# Altium project Battery Chargers BQ24072.PrjPcb
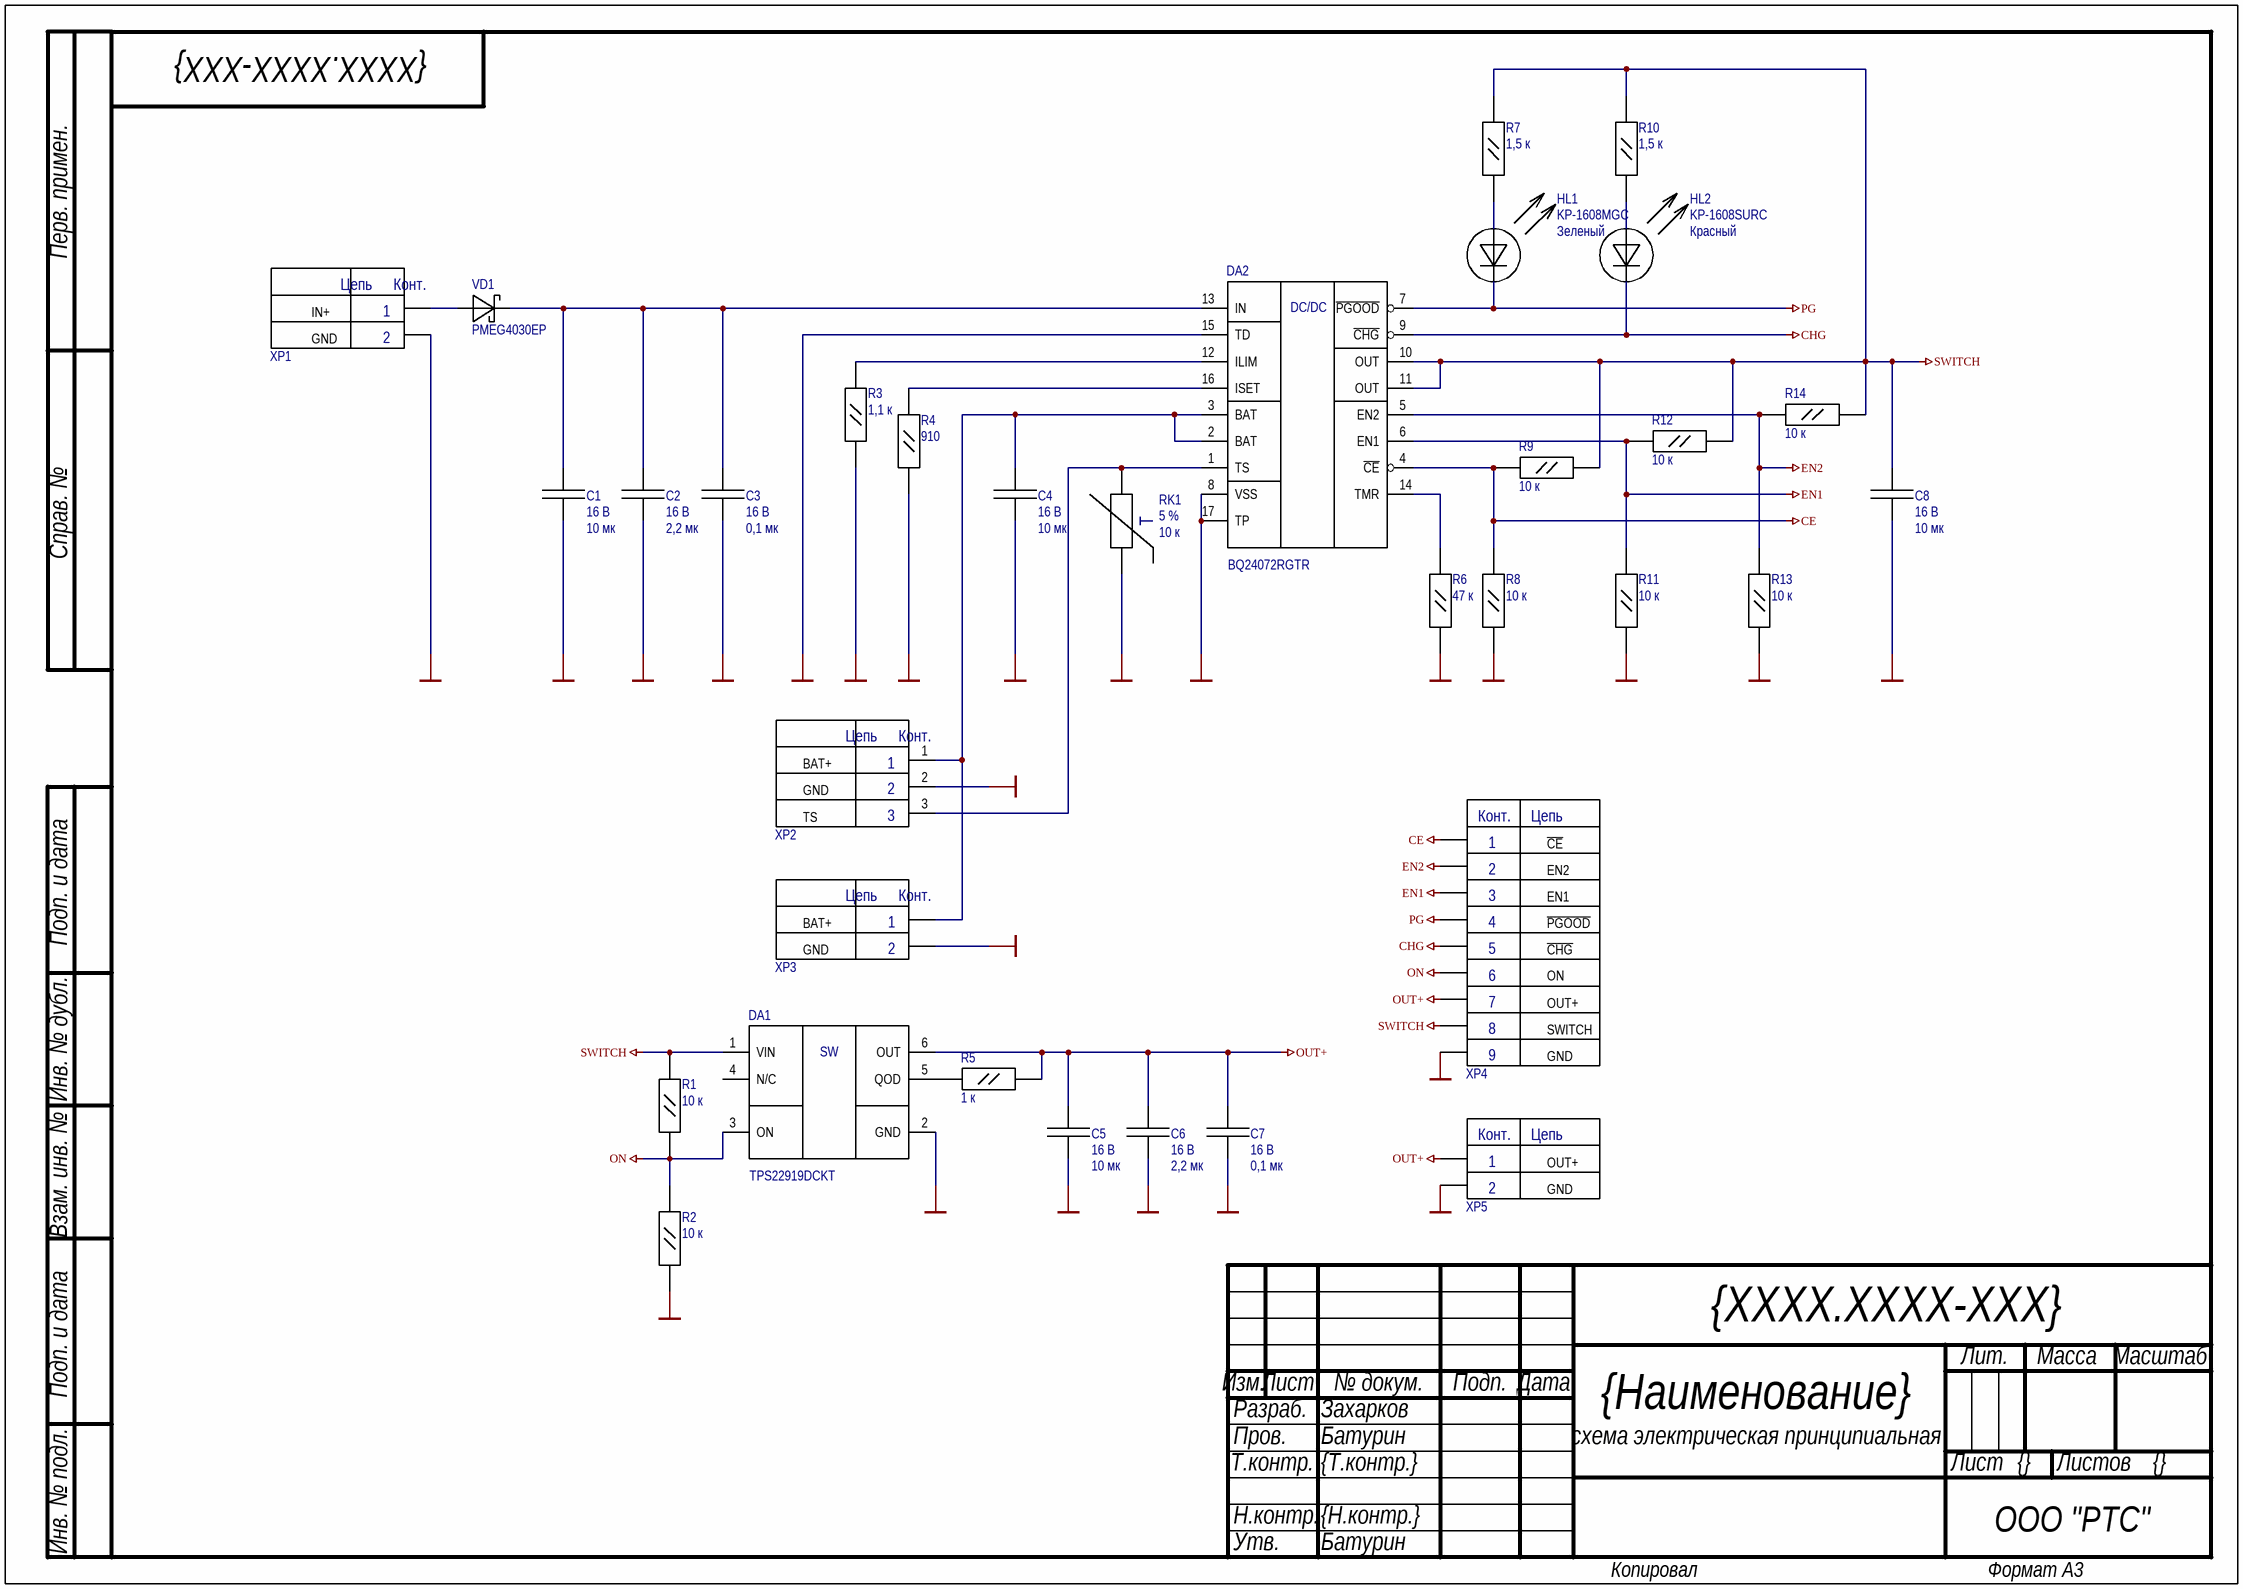
[diagram p0: Battery chargers.SchDoc]
ApprovedBy: Батурин; CheckedBy: Батурин; DocumentNumber: {XXXX.XXXX-XXX}; DrawnBy: Захарков; NormInspection: {Н.контр.}; Organization: ООО "РТС"; ProcessInspection: {Т.контр.}; Title: {Наименование}
1 sheet, 33 parts. Net scope: global (net labels, ports and power ports of the same name join across sheets).
Board file: Battery chargers.PcbDoc

## Sheet Battery chargers.SchDoc: {Наименование}
size 420 x 297 mm; ApprovedBy: Батурин; CheckedBy: Батурин; DrawnBy: Захарков; Organization: ООО "РТС"; DocumentNumber: {XXXX.XXXX-XXX} Э3; SheetNumber: {}; SheetTotal: {}; PageSetup: Record=PageOptions|CenterHorizontal=False|CenterVertical=False|PrintScale=0.95|XCorrection=0.00|YCorrection=0.00|PrintKind=1|BorderSize=5000000|LeftOffset=0|BottomOffset=0|Orientation=1|PaperLength=1000|PaperWidth=1000|Scale=100|PaperSource=15|PrintQuality=600|MediaType=1|DitherType=10|PaperKind=A4|PrintScaleMode=1; NormInspection: {Н.контр.}; DocumentType1str: схема электрическая принципиальная; Rule: PcbType=ProtelPcb

### Parts
C1  value 10 мк  Rated voltage: 16 В  [C_0603_Manual_mount]  (hidden comment: GRM188R61C106MA73)
C2  value 2,2 мк  Rated voltage: 16 В  [C_0603_Manual_mount]  (hidden comment: GRM188R61C225KE15)
C3  value 0,1 мк  Rated voltage: 16 В  [C_0603_Manual_mount]  (hidden comment: CC0603KRX7R7BB104)
C4  value 10 мк  Rated voltage: 16 В  [C_0603_Manual_mount]  (hidden comment: GRM188R61C106MA73)
C5  value 10 мк  Rated voltage: 16 В  [C_0603_Manual_mount]  (hidden comment: GRM188R61C106MA73)
C6  value 2,2 мк  Rated voltage: 16 В  [C_0603_Manual_mount]  (hidden comment: GRM188R61C225KE15)
C7  value 0,1 мк  Rated voltage: 16 В  [C_0603_Manual_mount]  (hidden comment: CC0603KRX7R7BB104)
C8  value 10 мк  Rated voltage: 16 В  [C_0603_Manual_mount]  (hidden comment: GRM188R61C106MA73)
DA1  TPS22919DCKT  [SC70]
DA2  BQ24072RGTR  [VQFN-16]
HL1  KP-1608MGC  Color: Зеленый  [LED_0603_Green_Manual_mount]
HL2  KP-1608SURC  Color: Красный  [LED_0603_Red_Manual_mount]
R1  value 10 к  [R_0603_Manual_mount]  (hidden comment: RC0603JR-0710KL)
R2  value 10 к  [R_0603_Manual_mount]  (hidden comment: RC0603JR-0710KL)
R3  value 1,1 к  [R_0603_Manual_mount]  (hidden comment: RC0603JR-071K1L)
R4  value 910  [R_0603_Manual_mount]  (hidden comment: RC0603JR-07910RL)
R5  value 1 к  [R_0603_Manual_mount]  (hidden comment: RC0603JR-071KL)
R6  value 47 к  [R_0603_Manual_mount]  (hidden comment: RC0603JR-0747KL)
R7  value 1,5 к  [R_0603_Manual_mount]  (hidden comment: RC0603JR-071K5L)
R8  value 10 к  [R_0603_Manual_mount]  (hidden comment: RC0603JR-0710KL)
R9  value 10 к  [R_0603_Manual_mount]  (hidden comment: RC0603JR-0710KL)
R10  value 1,5 к  [R_0603_Manual_mount]  (hidden comment: RC0603JR-071K5L)
R11  value 10 к  [R_0603_Manual_mount]  (hidden comment: RC0603JR-0710KL)
R12  value 10 к  [R_0603_Manual_mount]  (hidden comment: RC0603JR-0710KL)
R13  value 10 к  [R_0603_Manual_mount]  (hidden comment: RC0603JR-0710KL)
R14  value 10 к  [R_0603_Manual_mount]  (hidden comment: RC0603JR-0710KL)
RK1  value 10 к  Tolerance: 5 %  [RK_0603_Manual_Mount]  (hidden comment: NTHS0603N02N1002J)
VD1  PMEG4030EP  [SOD-128]
XP1  DS1069-2MVW6X  [DS1069-2MVxxX]  (value not drawn)
XP2  DS1069-3MVW6X  [DS1069-3MVW6X]  (value not drawn)
XP3  DS1069-2MVW6X  [DS1069-2MVxxX]  (value not drawn)
XP4  PLS-9  [PLS-9]  (value not drawn)
XP5  DS1069-2MVW6X  [DS1069-2MVxxX]  (value not drawn)

### Nets
CE: DA2.4(~{CE}) R8.2 R9.1 XP4.1
CHG: DA2.9(~{CHG}) HL2.C XP4.5
EN1: DA2.6(EN1) R11.2 R12.1 XP4.3
EN2: DA2.5(EN2) R13.2 R14.1 XP4.2
GND: C1.2 C2.2 C3.2 C4.2 C5.2 C6.2 C7.2 C8.2 DA1.2(GND) DA2.8(VSS) DA2.15(TD) DA2.17(TP) R2.1 R3.1 R4.1 R6.1 R8.1 R11.1 R13.1 RK1.1 XP1.2 XP2.2 XP3.2 XP4.9 XP5.2
ON: DA1.3(ON) R1.1 R2.2 XP4.6
OUT+: C5.1 C6.1 C7.1 DA1.6(OUT) R5.2 XP4.7 XP5.1
PG: DA2.7(~{PGOOD}) HL1.C XP4.4
SWITCH: C8.1 DA1.1(VIN) DA2.10(OUT) DA2.11(OUT) R1.2 R7.2 R9.2 R10.2 R12.2 R14.2 XP4.8
NetC1_1: C1.1 C2.1 C3.1 DA2.13(IN) VD1.C
NetC4_1: C4.1 DA2.2(BAT) DA2.3(BAT) XP2.1 XP3.1
NetDA1_5: DA1.5(QOD) R5.1
NetDA2_1: DA2.1(TS) RK1.2 XP2.3
NetDA2_12: DA2.12(ILIM) R3.2
NetDA2_14: DA2.14(TMR) R6.2
NetDA2_16: DA2.16(ISET) R4.2
NetHL1_A: HL1.A R7.1
NetHL2_A: HL2.A R10.1
NetVD1_A: VD1.A XP1.1

Not connected (* = marked no-connect by the designer): DA1 4(N/C)

### Notes on the sheet
- IN+
- GND
- BAT+
- TS
- SWITCH
- OUT+
- Labels drawn without touching a wire or pin: EN1, EN2, ON, ~{CE}, ~{CHG}, ~{PGOOD}
- Перв. примен.
- Справ. №
- Подп. и дата
- Инв. № дубл.
- Взам. инв. №
- Изм.
- Лист
- № докум.
- Подп.
- Дата
- Лит.
- Масса
- Масштаб
- Т.контр.
- Пров.
- Разраб.
- Листов
- Инв. № подл.
- Н.контр.
- Утв.
- Копировал
- Формат А3
- (in symbol BQ24072RGTR) DC/DC
- (in symbol DS1069-2MVW6X) Цепь; Конт.
- (in symbol DS1069-3MVW6X) Цепь; Конт.
- (in symbol NTHS0603N02N1002J) T
- (in symbol PLS-9) Конт.; Цепь
- (in symbol TPS22919DCKT) SW

### Library data of the parts
C1 C4 C5 C8 = GRM188R61C106MA73: Chip Monolithic Ceramic Capacitor; Manufacturer: Murata Manufacturing; Tolerance: 20 %; Temperature coefficient: ±15 %; Type: Конденсатор керамический; TC: X5R; Size: 0603; Temperature range: -55 ... 85 °C; Part Number: GRM188R61C106MA73
C2 C6 = GRM188R61C225KE15: Chip Monolithic Ceramic Capacitor; Manufacturer: Murata Manufacturing; Tolerance: 10 %; Temperature coefficient: ±15 %; Type: Конденсатор керамический; TC: X5R; Size: 0603; Temperature range: -55 ... 85 °C; Part Number: GRM188R61C225KE15
C3 C7 = CC0603KRX7R7BB104: Surface-mount Ceramic Multilayer Capacitor; Manufacturer: YAGEO; Tolerance: 10 %; Temperature coefficient: ±15 %; Type: Конденсатор керамический; TC: X7R; Size: 0603; Temperature range: -55 ... 125 °C; Part Number: CC0603KRX7R7BB104
DA1 = TPS22919DCKT: 5.5 V, 1.5 A, 90-mΩ Self-Protected Load Switch with Controlled Rise Time; Manufacturer: Texas Instruments; Rds: 89 ... 105 мОм; Operating voltage: 1,6 ... 5,5  В; Current limit: 1,5 А; Type: Силовой электронный ключ; Temperature range: -40 ... 125 C
DA2 = BQ24072RGTR: Standalone 1-Cell 1.5-A Linear Battery Chargers with Power Path; Manufacturer: Texas Instruments; Output voltage: 4.2 В; Input voltage: 4,35 ... 6,6 В; Voltage accuracy: ±1%; Charge current: 0,1 ... 1,5 А; Battery type: Li-Ion/Li-Poly; Number of cells: 1; Type: Контроллер АКБ; Temperature range: -40 ... 125  °C; Standard: Fast Charge
HL1 = KP-1608MGC: SMD LED; Manufacturer: Kingbright; Forward voltage: 2,1 В; Power dissitipation: 75 мВт; Type: Светодиод; Max. forward current: 30 мА; Max. reverse voltage: 5 В; Size: 0603; Temperature range: -40 ... 85 °C
HL2 = KP-1608SURC: SMD LED; Manufacturer: Kingbright; Forward voltage: 1,9 В; Power dissitipation: 170 мВт; Type: Светодиод; Max. forward current: 30 мА; Max. reverse voltage: 5 В; Size: 0603; Temperature range: -40 ... 85 °C
R1 R2 R8 R9 R11-R14 = RC0603JR-0710KL: General Purpose Chip Resistor; Manufacturer: YAGEO; Tolerance: 5 %; Power dissipation: 0,1 Вт; Temperature coefficient: ±100 ppm/°C; Size: 0603; Temperature range: -55 ... 155 °C; Type: Резистор постоянный; Part Number: RC0603JR-0710KL
R3 = RC0603JR-071K1L: General Purpose Chip Resistor; Manufacturer: YAGEO; Tolerance: 5 %; Power dissipation: 0,1 Вт; Temperature coefficient: ±100 ppm/°C; Size: 0603; Temperature range: -55 ... 155 °C; Type: Резистор постоянный; Part Number: RC0603JR-071K1L
R4 = RC0603JR-07910RL: General Purpose Chip Resistor; Manufacturer: YAGEO; Tolerance: 5 %; Power dissipation: 0,1 Вт; Temperature coefficient: ±100 ppm/°C; Size: 0603; Temperature range: -55 ... 155 °C; Type: Резистор постоянный; Part Number: RC0603JR-07910RL
R5 = RC0603JR-071KL: General Purpose Chip Resistor; Manufacturer: YAGEO; Tolerance: 5 %; Power dissipation: 0,1 Вт; Temperature coefficient: ±100 ppm/°C; Size: 0603; Temperature range: -55 ... 155 °C; Type: Резистор постоянный; Part Number: RC0603JR-071KL
R6 = RC0603JR-0747KL: General Purpose Chip Resistor; Manufacturer: YAGEO; Tolerance: 5 %; Power dissipation: 0,1 Вт; Temperature coefficient: ±100 ppm/°C; Size: 0603; Temperature range: -55 ... 155 °C; Type: Резистор постоянный; Part Number: RC0603JR-0747KL
R7 R10 = RC0603JR-071K5L: General Purpose Chip Resistor; Manufacturer: YAGEO; Tolerance: 5 %; Power dissipation: 0,1 Вт; Temperature coefficient: ±100 ppm/°C; Size: 0603; Temperature range: -55 ... 155 °C; Type: Резистор постоянный; Part Number: RC0603JR-071K5L
RK1 = NTHS0603N02N1002J: NTC Thermistor; Manufacturer: Vishay; B tolerance: 3%; Power dissipation: 0,1 Вт; B(25-85 °C): 3486 К; B(25-75 °C): 3477 К; Size: 0603; Temperature range: -40 ... 125 °C; Type: Термистор; Part Number: NTHS0603N02N1002J
VD1 = PMEG4030EP: 3 A low VF MEGA Schottky barrier rectifier; Manufacturer: NXP; Type: Диод Шоттки; Max average forward current: 3 А; Max reverse voltage: 40 В; Forward voltage: 0,49 В; Max non-repetitive peak forward current: 50 А; Temperature range: -55 ... 150 °C
XP1 XP3 XP5 = DS1069-2MVW6X: 2.5mm-step power connector; Manufacturer: CONNFLY; Connector type: Вилка на плату; Number of contacts: 2; Type: Разъем штыревой
XP2 = DS1069-3MVW6X: 2.5mm-step power connector; Manufacturer: CONNFLY; Connector type: Вилка на плату; Number of contacts: 3; Type: Разъем штыревой
XP4 = PLS-9: PLS connector; Manufacturer: NONAME; Connector type: Вилка на плату; Number of contacts: 9; Type: Разъем штыревой

## Assembly variants
Thermistor on the battery: not fitted R7 R10 RK1 XP3
No thermistor on the battery: not fitted R7 R10 XP2